# EasyEDA schematic SCH_R2.json

## Sheets
1 Atmega MCU copy: TITLE: Keyboard Atmega Controller; REV: 1.0; Date: 2022-01-07; Sheet: 1/1; Drawn By: @Engr. Ahsan Awan; Company: WhatsApp(+923491540717)
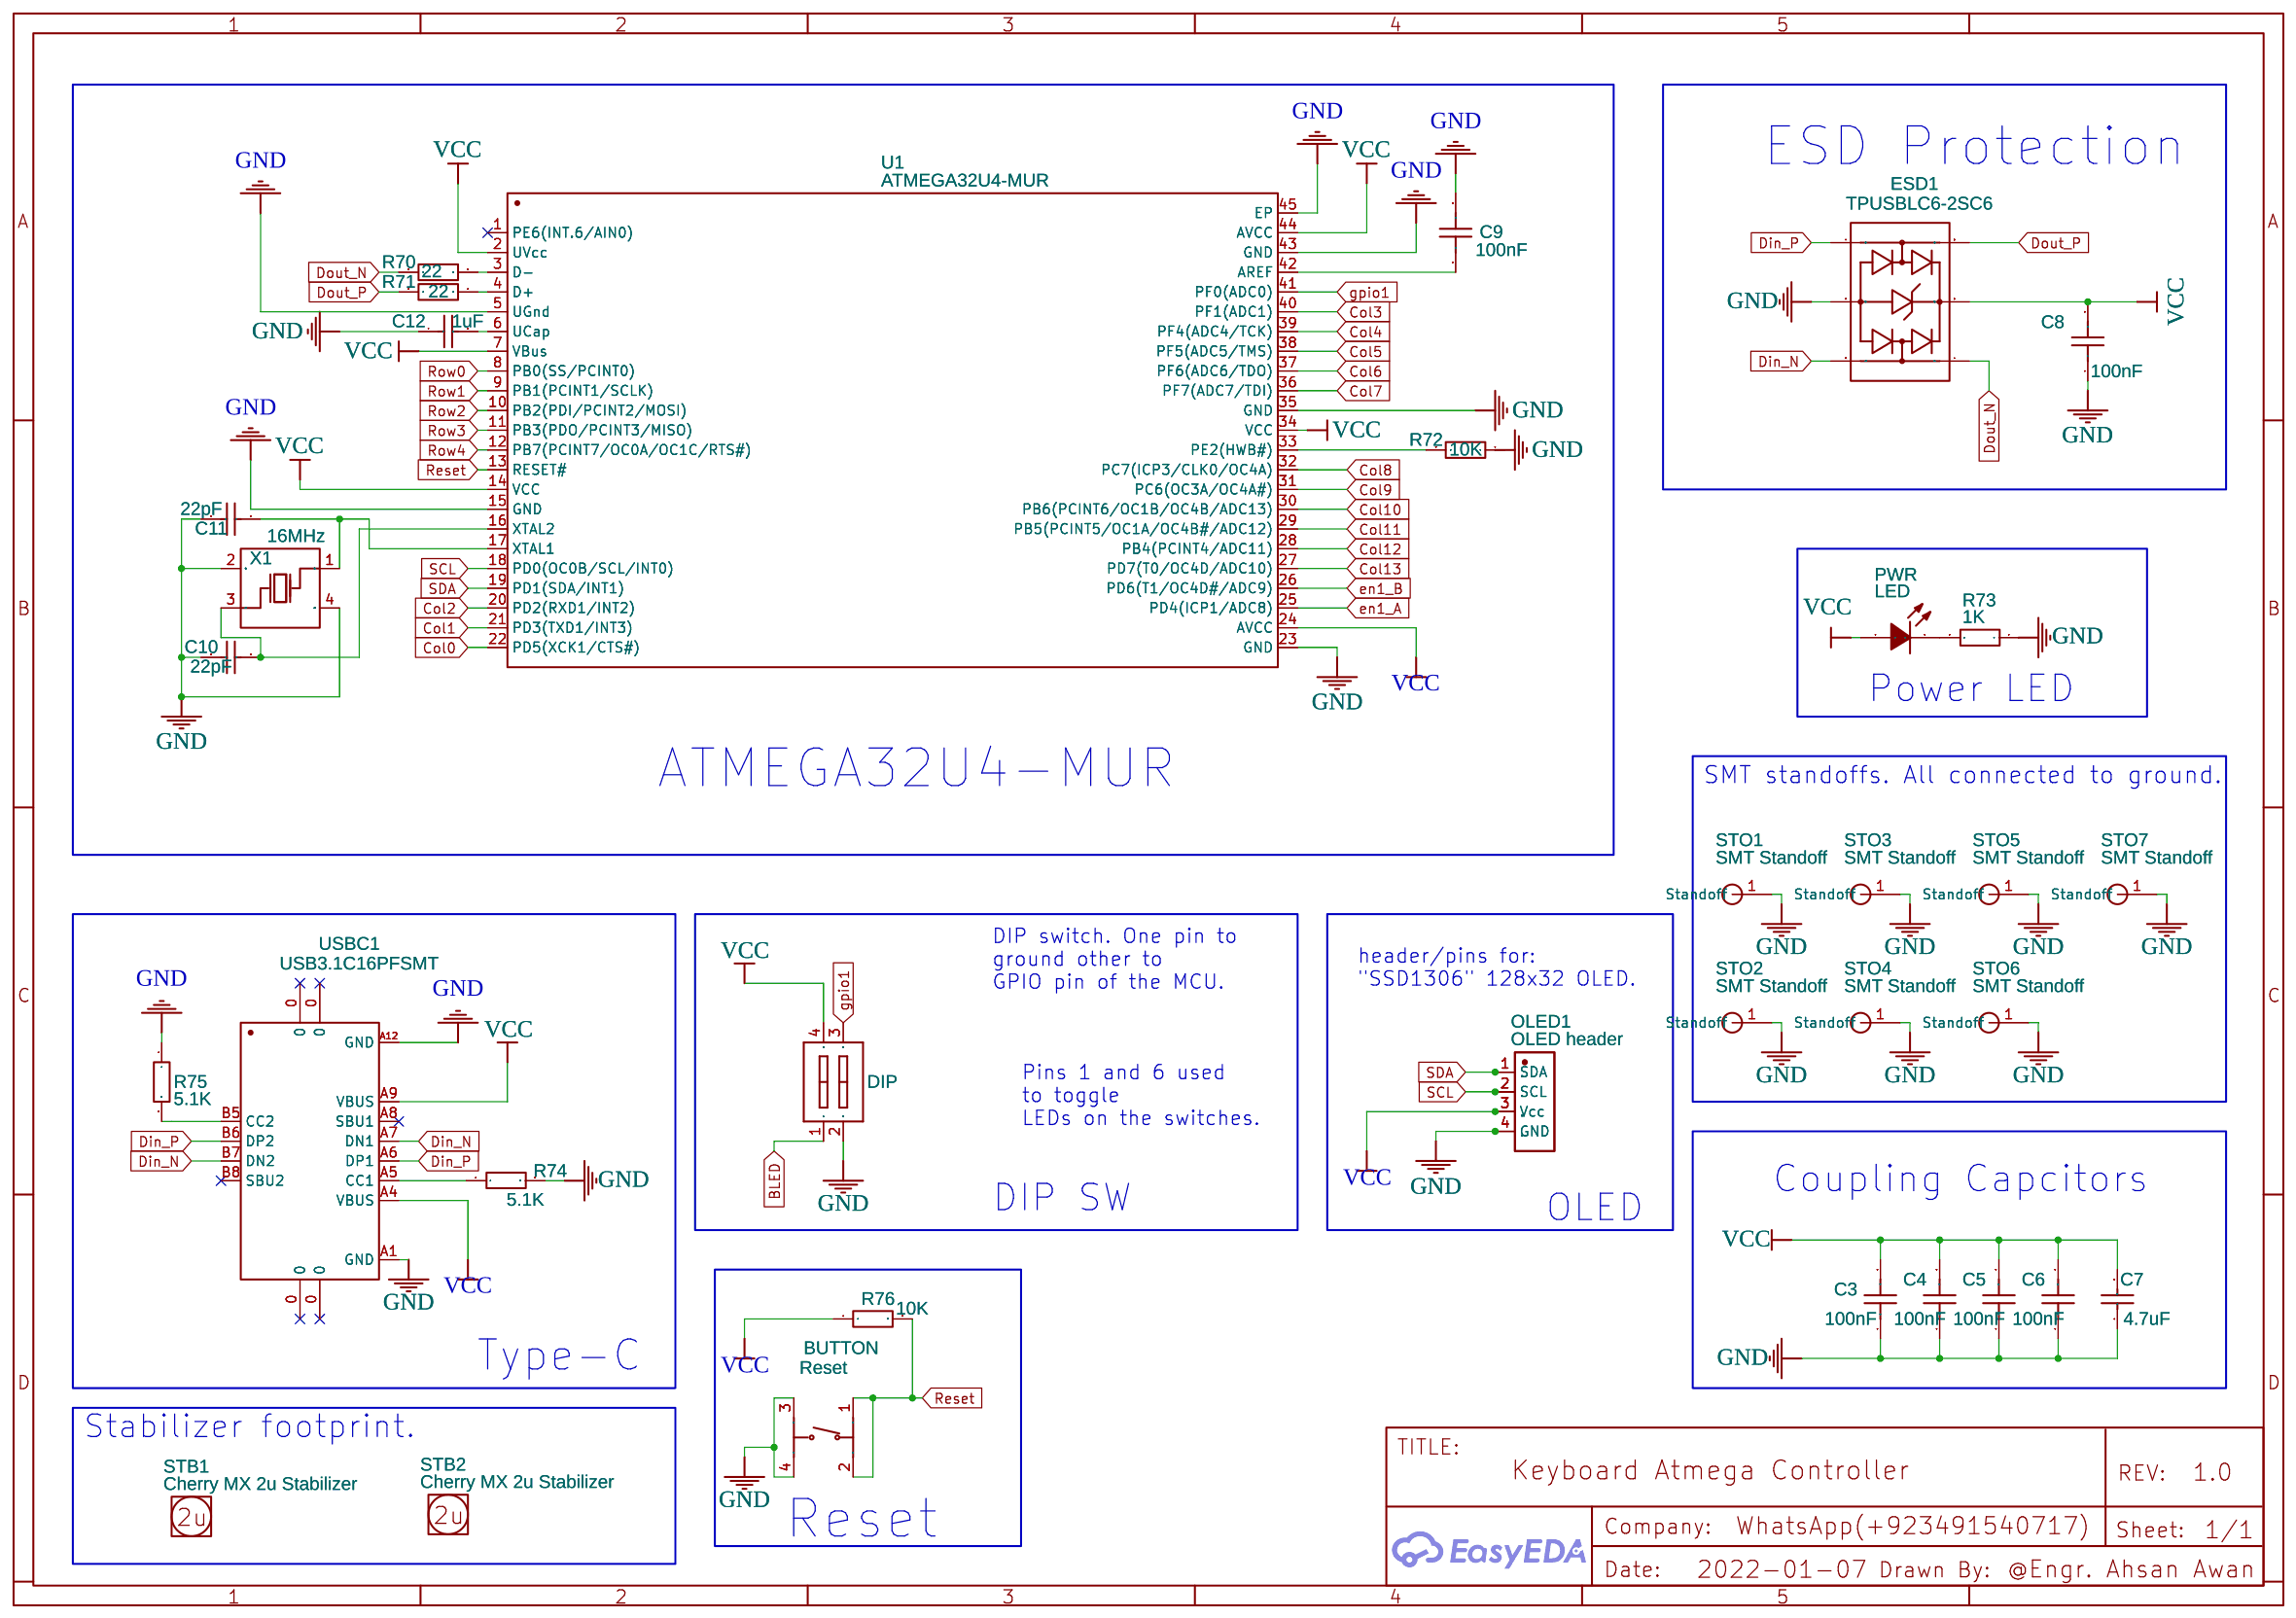
[diagram p0: Atmega MCU copy]
2 First 6 Colimn: TITLE: Switch Matrix; Date: 2022-01-30; Company: Your Company
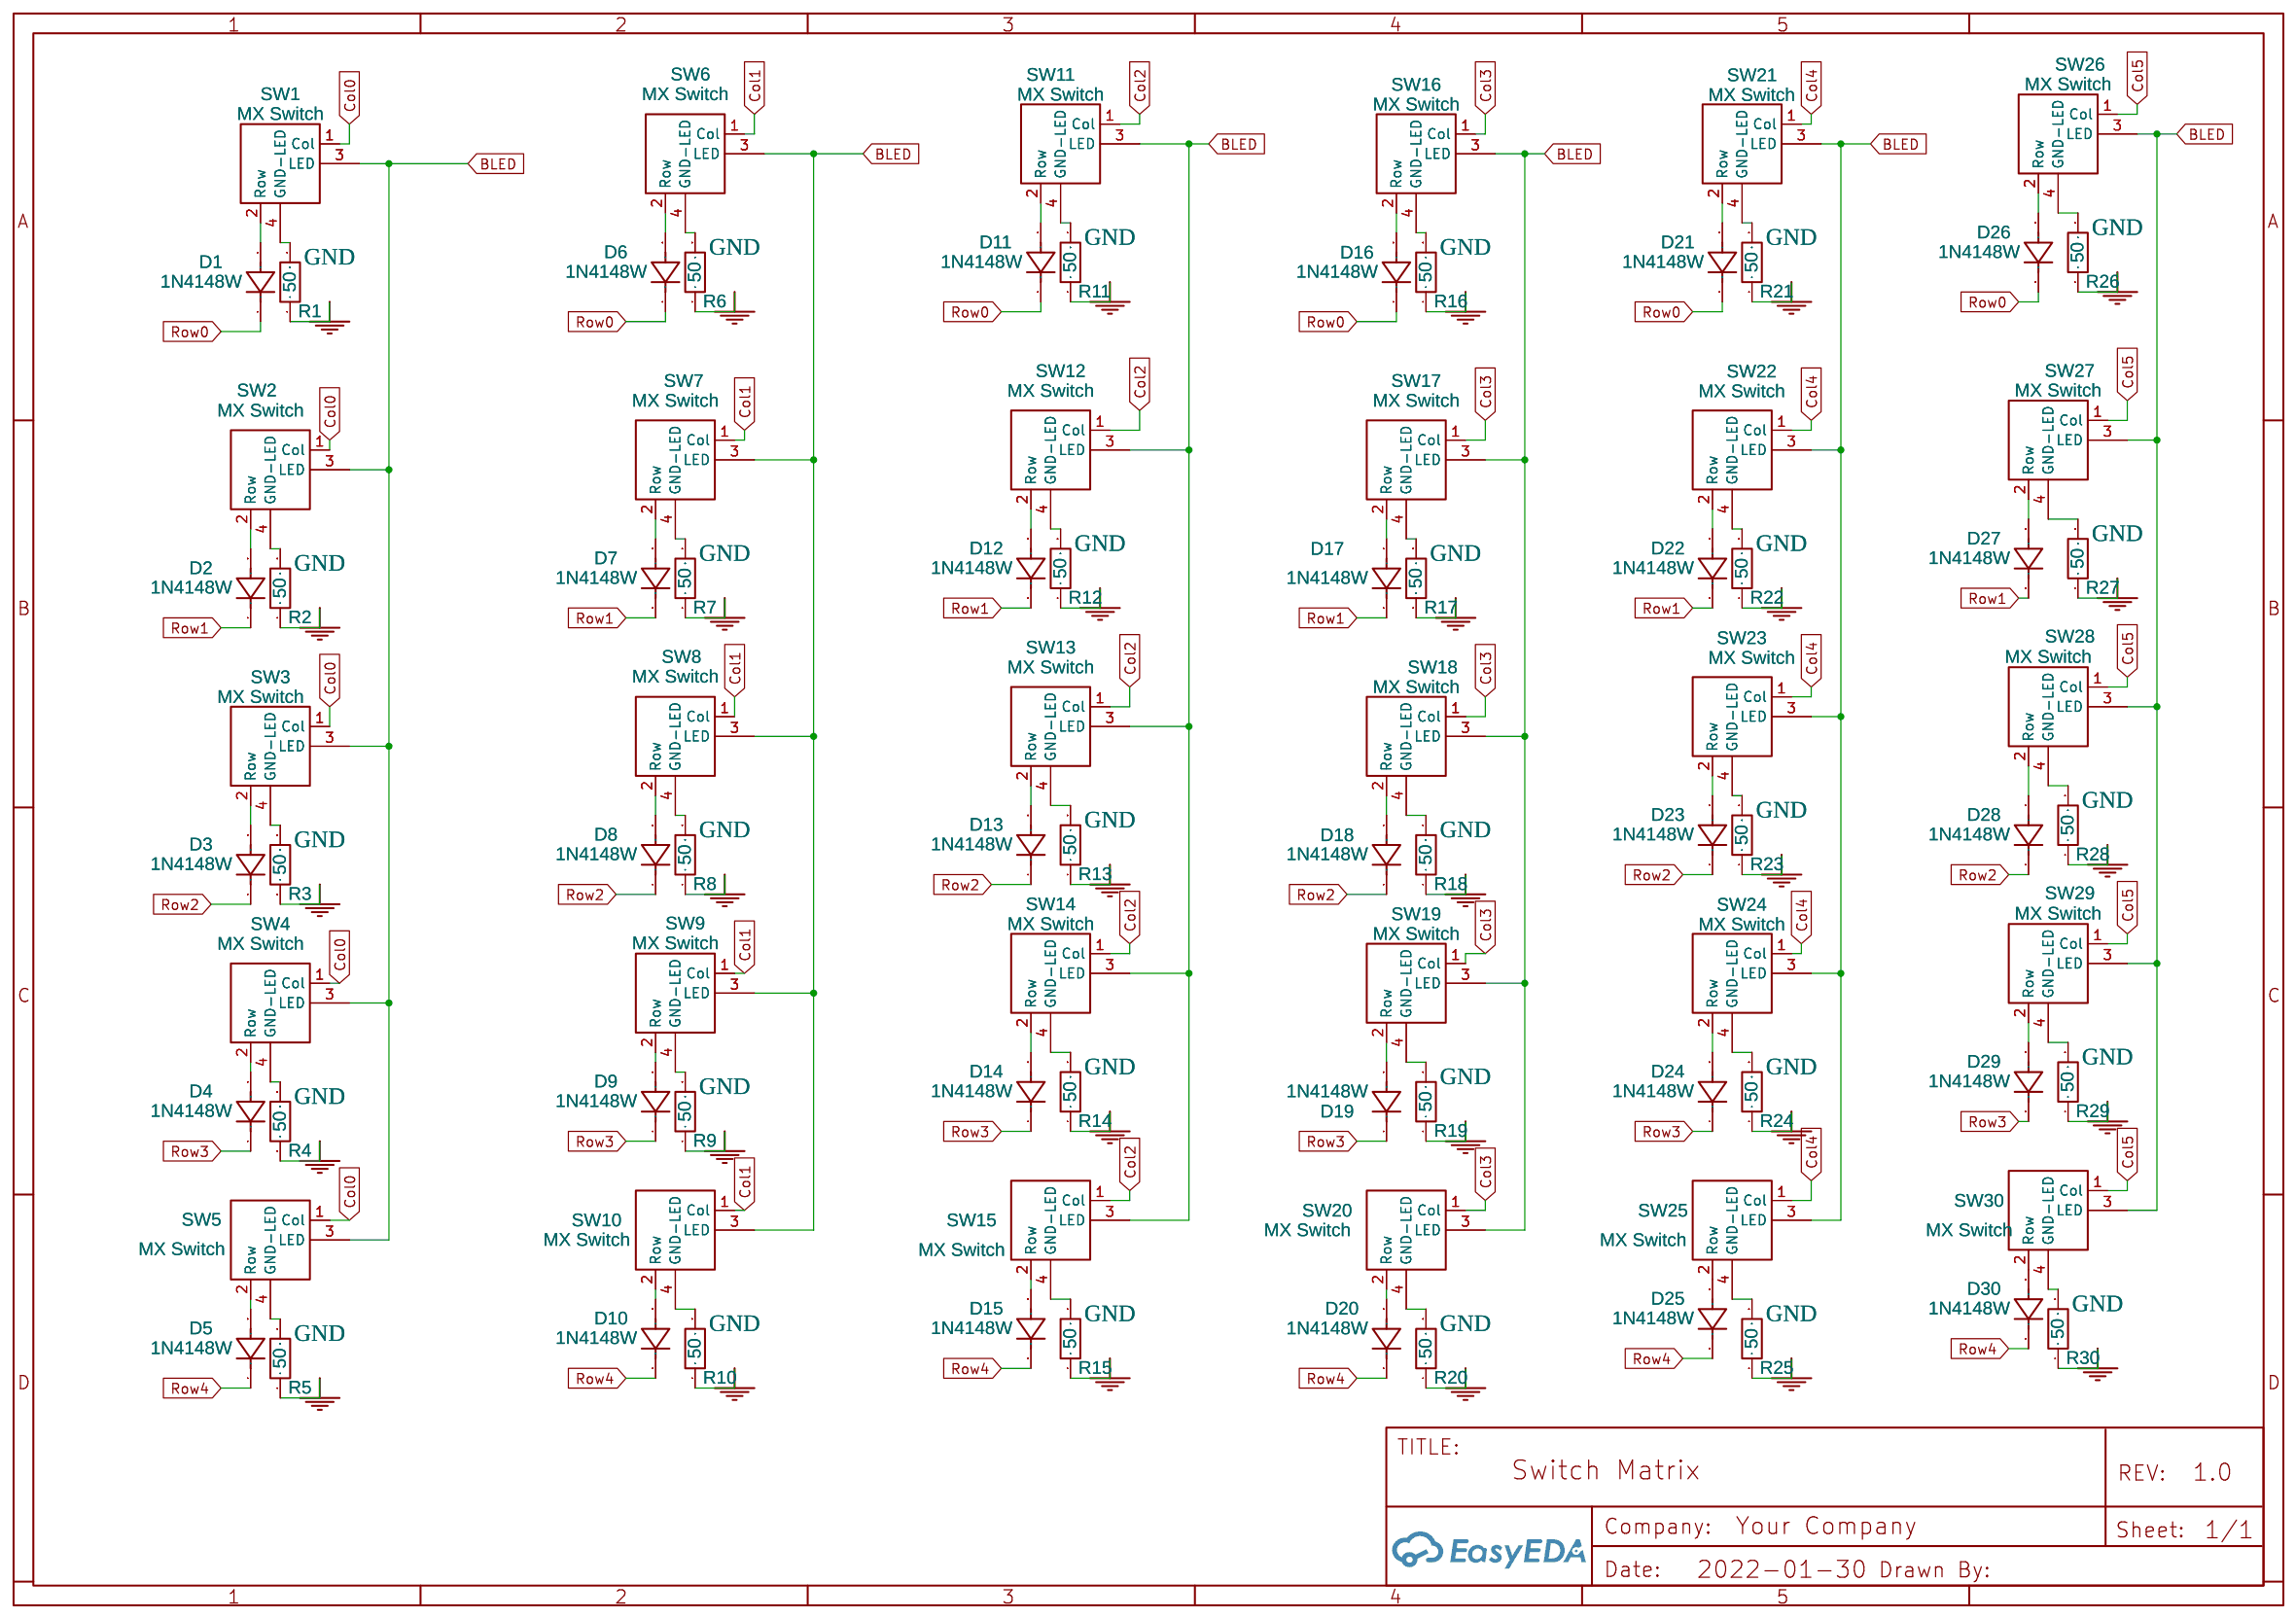
[diagram p1: First 6 Colimn]
3 Last 8 Col: TITLE: Switch Matrix; REV: 1.1
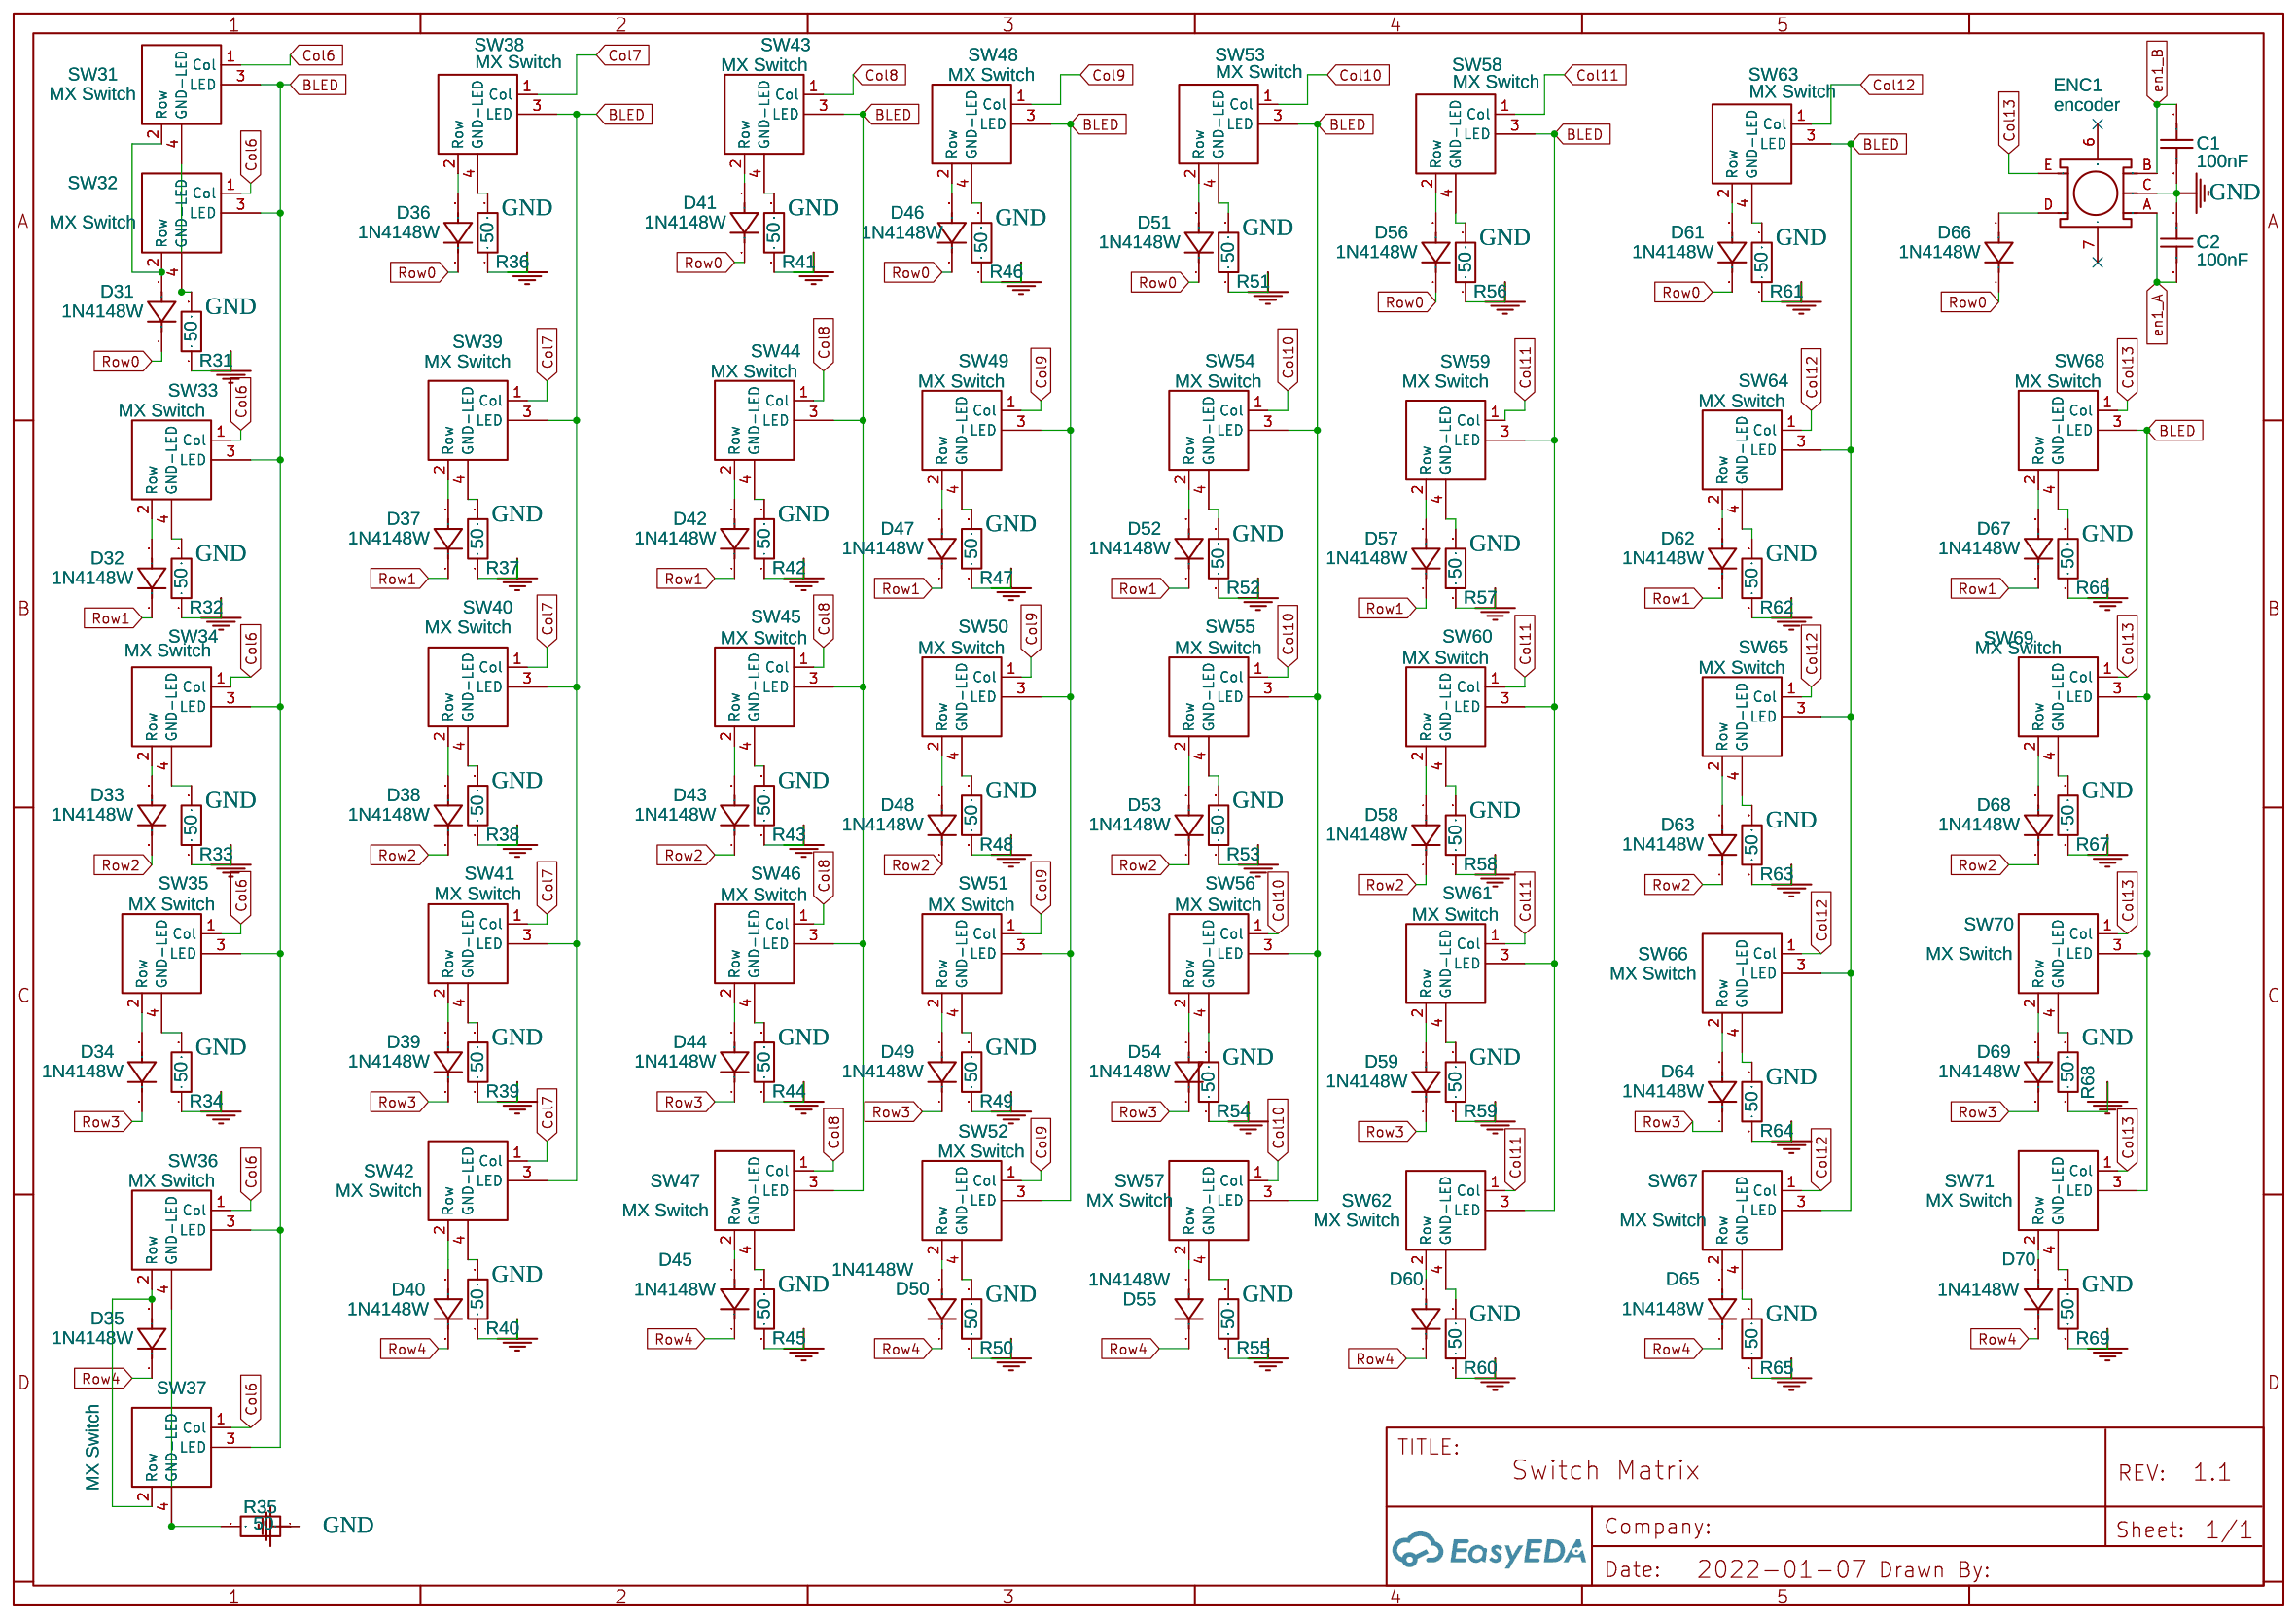
[diagram p2: Last 8 Col]

## Parts
sheet Atmega MCU copy
BUTTON  Reset  [SW-SMD_4P-L5.1-W5.1-P3.70-LS6.5-TL-2]
C3  100nF  [C0603]
C4  100nF  [C0603]
C5  100nF  [C0603]
C6  100nF  [C0603]
C7  4.7uF  [C0603]
C8  100nF  [C0603]
C9  100nF  [C0603]
C10  22pF  [C0603]
C11  22pF  [C0603]
C12  1uF  [C0603]
DIP  DSIC02LS-P_C489174  [SW-SMD_4P-L5.1-W6.1-P2.54-LS9.8]
ESD1  TPUSBLC6-2SC6  [SOT-23-6_L2.9-W1.6-P0.95-LS2.8-BR]
OLED1  OLED header  [HDR-SMD_4P-P2.00-H-M-W6.0-N]
PWR  LED  [LED0805-R-RD]
R70  22  [R0603]
R71  22  [R0603]
R72  10K  [R0603]
R73  1K  [R0603]
R74  5.1K  [R0603]
R75  5.1K  [R0603]
R76  10K  [R0603]
STB1  Cherry MX 2u Stabilizer  [MX1A STABILIZER 2U]
STB2  Cherry MX 2u Stabilizer  [MX1A STABILIZER 2U]
STO1  SMT Standoff  [SMT STANDOFF]
STO2  SMT Standoff  [SMT STANDOFF]
STO3  SMT Standoff  [SMT STANDOFF]
STO4  SMT Standoff  [SMT STANDOFF]
STO5  SMT Standoff  [SMT STANDOFF]
STO6  SMT Standoff  [SMT STANDOFF]
STO7  SMT Standoff  [SMT STANDOFF]
U1  ATMEGA32U4-MUR  [VQFN-44_L7.0-W7.0-P0.50-BL-EP5.2]
U2  x  [1X04-CLEANBIG]
USBC1  USB3.1C16PFSMT  [USB-C-SMD_TYPE-C-USB-17]
X1  16MHz  [OSC-SMD_4P-L3.2-W2.5-BL]
sheet First 6 Colimn
D1  1N4148W  [SOD-123_L2.7-W1.6-LS3.7-RD]
D2  1N4148W  [SOD-123_L2.7-W1.6-LS3.7-RD]
D3  1N4148W  [SOD-123_L2.7-W1.6-LS3.7-RD]
D4  1N4148W  [SOD-123_L2.7-W1.6-LS3.7-RD]
D5  1N4148W  [SOD-123_L2.7-W1.6-LS3.7-RD]
D6  1N4148W  [SOD-123_L2.7-W1.6-LS3.7-RD]
D7  1N4148W  [SOD-123_L2.7-W1.6-LS3.7-RD]
D8  1N4148W  [SOD-123_L2.7-W1.6-LS3.7-RD]
D9  1N4148W  [SOD-123_L2.7-W1.6-LS3.7-RD]
D10  1N4148W  [SOD-123_L2.7-W1.6-LS3.7-RD]
D11  1N4148W  [SOD-123_L2.7-W1.6-LS3.7-RD]
D12  1N4148W  [SOD-123_L2.7-W1.6-LS3.7-RD]
D13  1N4148W  [SOD-123_L2.7-W1.6-LS3.7-RD]
D14  1N4148W  [SOD-123_L2.7-W1.6-LS3.7-RD]
D15  1N4148W  [SOD-123_L2.7-W1.6-LS3.7-RD]
D16  1N4148W  [SOD-123_L2.7-W1.6-LS3.7-RD]
D17  1N4148W  [SOD-123_L2.7-W1.6-LS3.7-RD]
D18  1N4148W  [SOD-123_L2.7-W1.6-LS3.7-RD]
D19  1N4148W  [SOD-123_L2.7-W1.6-LS3.7-RD]
D20  1N4148W  [SOD-123_L2.7-W1.6-LS3.7-RD]
D21  1N4148W  [SOD-123_L2.7-W1.6-LS3.7-RD]
D22  1N4148W  [SOD-123_L2.7-W1.6-LS3.7-RD]
D23  1N4148W  [SOD-123_L2.7-W1.6-LS3.7-RD]
D24  1N4148W  [SOD-123_L2.7-W1.6-LS3.7-RD]
D25  1N4148W  [SOD-123_L2.7-W1.6-LS3.7-RD]
D26  1N4148W  [SOD-123_L2.7-W1.6-LS3.7-RD]
D27  1N4148W  [SOD-123_L2.7-W1.6-LS3.7-RD]
D28  1N4148W  [SOD-123_L2.7-W1.6-LS3.7-RD]
D29  1N4148W  [SOD-123_L2.7-W1.6-LS3.7-RD]
D30  1N4148W  [SOD-123_L2.7-W1.6-LS3.7-RD]
R1  50  [R0603]
R2  50  [R0603]
R3  50  [R0603]
R4  50  [R0603]
R5  50  [R0603]
R6  50  [R0603]
R7  50  [R0603]
R8  50  [R0603]
R9  50  [R0603]
R10  50  [R0603]
R11  50  [R0603]
R12  50  [R0603]
R13  50  [R0603]
R14  50  [R0603]
R15  50  [R0603]
R16  50  [R0603]
R17  50  [R0603]
R18  50  [R0603]
R19  50  [R0603]
R20  50  [R0603]
R21  50  [R0603]
R22  50  [R0603]
R23  50  [R0603]
R24  50  [R0603]
R25  50  [R0603]
R26  50  [R0603]
R27  50  [R0603]
R28  50  [R0603]
R29  50  [R0603]
R30  50  [R0603]
SW1  MX Switch  [MX-ALPS-CHOC-SWITCH]
SW2  MX Switch  [MX-ALPS-CHOC-SWITCH]
SW3  MX Switch  [MX-ALPS-CHOC-SWITCH]
SW4  MX Switch  [MX-ALPS-CHOC-SWITCH]
SW5  MX Switch  [MX-ALPS-CHOC-SWITCH]
SW6  MX Switch  [MX-ALPS-CHOC-SWITCH]
SW7  MX Switch  [MX-ALPS-CHOC-SWITCH]
SW8  MX Switch  [MX-ALPS-CHOC-SWITCH]
SW9  MX Switch  [MX-ALPS-CHOC-SWITCH]
SW10  MX Switch  [MX-ALPS-CHOC-SWITCH]
SW11  MX Switch  [MX-ALPS-CHOC-SWITCH]
SW12  MX Switch  [MX-ALPS-CHOC-SWITCH]
SW13  MX Switch  [MX-ALPS-CHOC-SWITCH]
SW14  MX Switch  [MX-ALPS-CHOC-SWITCH]
SW15  MX Switch  [MX-ALPS-CHOC-SWITCH]
SW16  MX Switch  [MX-ALPS-CHOC-SWITCH]
SW17  MX Switch  [MX-ALPS-CHOC-SWITCH]
SW18  MX Switch  [MX-ALPS-CHOC-SWITCH]
SW19  MX Switch  [MX-ALPS-CHOC-SWITCH]
SW20  MX Switch  [MX-ALPS-CHOC-SWITCH]
SW21  MX Switch  [MX-ALPS-CHOC-SWITCH]
SW22  MX Switch  [MX-ALPS-CHOC-SWITCH]
SW23  MX Switch  [MX-ALPS-CHOC-SWITCH]
SW24  MX Switch  [MX-ALPS-CHOC-SWITCH]
SW25  MX Switch  [MX-ALPS-CHOC-SWITCH]
SW26  MX Switch  [MX-ALPS-CHOC-SWITCH]
SW27  MX Switch  [MX-ALPS-CHOC-SWITCH]
SW28  MX Switch  [MX-ALPS-CHOC-SWITCH]
SW29  MX Switch  [MX-ALPS-CHOC-SWITCH]
SW30  MX Switch  [MX-ALPS-CHOC-SWITCH]
sheet Last 8 Col
C1  100nF  [C0603]
C2  100nF  [C0603]
D31  1N4148W  [SOD-123_L2.7-W1.6-LS3.7-RD]
D32  1N4148W  [SOD-123_L2.7-W1.6-LS3.7-RD]
D33  1N4148W  [SOD-123_L2.7-W1.6-LS3.7-RD]
D34  1N4148W  [SOD-123_L2.7-W1.6-LS3.7-RD]
D35  1N4148W  [SOD-123_L2.7-W1.6-LS3.7-RD]
D36  1N4148W  [SOD-123_L2.7-W1.6-LS3.7-RD]
D37  1N4148W  [SOD-123_L2.7-W1.6-LS3.7-RD]
D38  1N4148W  [SOD-123_L2.7-W1.6-LS3.7-RD]
D39  1N4148W  [SOD-123_L2.7-W1.6-LS3.7-RD]
D40  1N4148W  [SOD-123_L2.7-W1.6-LS3.7-RD]
D41  1N4148W  [SOD-123_L2.7-W1.6-LS3.7-RD]
D42  1N4148W  [SOD-123_L2.7-W1.6-LS3.7-RD]
D43  1N4148W  [SOD-123_L2.7-W1.6-LS3.7-RD]
D44  1N4148W  [SOD-123_L2.7-W1.6-LS3.7-RD]
D45  1N4148W  [SOD-123_L2.7-W1.6-LS3.7-RD]
D46  1N4148W  [SOD-123_L2.7-W1.6-LS3.7-RD]
D47  1N4148W  [SOD-123_L2.7-W1.6-LS3.7-RD]
D48  1N4148W  [SOD-123_L2.7-W1.6-LS3.7-RD]
D49  1N4148W  [SOD-123_L2.7-W1.6-LS3.7-RD]
D50  1N4148W  [SOD-123_L2.7-W1.6-LS3.7-RD]
D51  1N4148W  [SOD-123_L2.7-W1.6-LS3.7-RD]
D52  1N4148W  [SOD-123_L2.7-W1.6-LS3.7-RD]
D53  1N4148W  [SOD-123_L2.7-W1.6-LS3.7-RD]
D54  1N4148W  [SOD-123_L2.7-W1.6-LS3.7-RD]
D55  1N4148W  [SOD-123_L2.7-W1.6-LS3.7-RD]
D56  1N4148W  [SOD-123_L2.7-W1.6-LS3.7-RD]
D57  1N4148W  [SOD-123_L2.7-W1.6-LS3.7-RD]
D58  1N4148W  [SOD-123_L2.7-W1.6-LS3.7-RD]
D59  1N4148W  [SOD-123_L2.7-W1.6-LS3.7-RD]
D60  1N4148W  [SOD-123_L2.7-W1.6-LS3.7-RD]
D61  1N4148W  [SOD-123_L2.7-W1.6-LS3.7-RD]
D62  1N4148W  [SOD-123_L2.7-W1.6-LS3.7-RD]
D63  1N4148W  [SOD-123_L2.7-W1.6-LS3.7-RD]
D64  1N4148W  [SOD-123_L2.7-W1.6-LS3.7-RD]
D65  1N4148W  [SOD-123_L2.7-W1.6-LS3.7-RD]
D66  1N4148W  [SOD-123_L2.7-W1.6-LS3.7-RD]
D67  1N4148W  [SOD-123_L2.7-W1.6-LS3.7-RD]
D68  1N4148W  [SOD-123_L2.7-W1.6-LS3.7-RD]
D69  1N4148W  [SOD-123_L2.7-W1.6-LS3.7-RD]
D70  1N4148W  [SOD-123_L2.7-W1.6-LS3.7-RD]
ENC1  encoder  [PRETTY_ENCODER]
NO?#1  NO
R31  50  [R0603]
R32  50  [R0603]
R33  50  [R0603]
R34  50  [R0603]
R35  50  [R0603]
R36  50  [R0603]
R37  50  [R0603]
R38  50  [R0603]
R39  50  [R0603]
R40  50  [R0603]
R41  50  [R0603]
R42  50  [R0603]
R43  50  [R0603]
R44  50  [R0603]
R45  50  [R0603]
R46  50  [R0603]
R47  50  [R0603]
R48  50  [R0603]
R49  50  [R0603]
R50  50  [R0603]
R51  50  [R0603]
R52  50  [R0603]
R53  50  [R0603]
R54  50  [R0603]
R55  50  [R0603]
R56  50  [R0603]
R57  50  [R0603]
R58  50  [R0603]
R59  50  [R0603]
R60  50  [R0603]
R61  50  [R0603]
R62  50  [R0603]
R63  50  [R0603]
R64  50  [R0603]
R65  50  [R0603]
R66  50  [R0603]
R67  50  [R0603]
R68  50  [R0603]
R69  50  [R0603]
SW31  MX Switch  [MX-ALPS-CHOC-SWITCH]
SW32  MX Switch  [MX-ALPS-CHOC-SWITCH]
SW33  MX Switch  [MX-ALPS-CHOC-SWITCH]
SW34  MX Switch  [MX-ALPS-CHOC-SWITCH]
SW35  MX Switch  [MX-ALPS-CHOC-SWITCH]
SW36  MX Switch  [MX-ALPS-CHOC-SWITCH]
SW37  MX Switch  [MX-ALPS-CHOC-SWITCH]
SW38  MX Switch  [MX-ALPS-CHOC-SWITCH]
SW39  MX Switch  [MX-ALPS-CHOC-SWITCH]
SW40  MX Switch  [MX-ALPS-CHOC-SWITCH]
SW41  MX Switch  [MX-ALPS-CHOC-SWITCH]
SW42  MX Switch  [MX-ALPS-CHOC-SWITCH]
SW43  MX Switch  [MX-ALPS-CHOC-SWITCH]
SW44  MX Switch  [MX-ALPS-CHOC-SWITCH]
SW45  MX Switch  [MX-ALPS-CHOC-SWITCH]
SW46  MX Switch  [MX-ALPS-CHOC-SWITCH]
SW47  MX Switch  [MX-ALPS-CHOC-SWITCH]
SW48  MX Switch  [MX-ALPS-CHOC-SWITCH]
SW49  MX Switch  [MX-ALPS-CHOC-SWITCH]
SW50  MX Switch  [MX-ALPS-CHOC-SWITCH]
SW51  MX Switch  [MX-ALPS-CHOC-SWITCH]
SW52  MX Switch  [MX-ALPS-CHOC-SWITCH]
SW53  MX Switch  [MX-ALPS-CHOC-SWITCH]
SW54  MX Switch  [MX-ALPS-CHOC-SWITCH]
SW55  MX Switch  [MX-ALPS-CHOC-SWITCH]
SW56  MX Switch  [MX-ALPS-CHOC-SWITCH]
SW57  MX Switch  [MX-ALPS-CHOC-SWITCH]
SW58  MX Switch  [MX-ALPS-CHOC-SWITCH]
SW59  MX Switch  [MX-ALPS-CHOC-SWITCH]
SW60  MX Switch  [MX-ALPS-CHOC-SWITCH]
SW61  MX Switch  [MX-ALPS-CHOC-SWITCH]
SW62  MX Switch  [MX-ALPS-CHOC-SWITCH]
SW63  MX Switch  [MX-ALPS-CHOC-SWITCH]
SW64  MX Switch  [MX-ALPS-CHOC-SWITCH]
SW65  MX Switch  [MX-ALPS-CHOC-SWITCH]
SW66  MX Switch  [MX-ALPS-CHOC-SWITCH]
SW67  MX Switch  [MX-ALPS-CHOC-SWITCH]
SW68  MX Switch  [MX-ALPS-CHOC-SWITCH]
SW69  MX Switch  [MX-ALPS-CHOC-SWITCH]
SW70  MX Switch  [MX-ALPS-CHOC-SWITCH]
SW71  MX Switch  [MX-ALPS-CHOC-SWITCH]

## Library data of the parts
BUTTON = TS-1187A-B-A-B: Supplier: LCSC; Supplier Part: C318884; Manufacturer: XKB Enterprise; Contributor: LCSC; JLCPCB Part Class: Extended Part
C1-C6 C8 C9 = CC0603KRX7R9BB104: Supplier: LCSC; Manufacturer: YAGEO; Supplier Part: C14663; JLCPCB Part Class: Basic Part
C7 = CL10A475KO8NNNC: Supplier: LCSC; Manufacturer: SAMSUNG; Supplier Part: C19666; JLCPCB Part Class: Basic Part
C10 C11 = CL10C220JB8NNNC: Supplier: LCSC; Manufacturer: SAMSUNG; Supplier Part: C1653; JLCPCB Part Class: Basic Part
C12 = CL10A105KB8NNNC: Supplier: LCSC; Manufacturer: SAMSUNG; Supplier Part: C15849; JLCPCB Part Class: Basic Part
DIP = DSIC02LS-P_C489174: Supplier: LCSC; Supplier Part: C489174; Manufacturer: XKB Enterprise; Manufacturer Part: DSIC02LS-P; Contributor: LCSC; JLCPCB Part Class: Extended Part
ESD1 = TPUSBLC6-2SC6: Supplier: LCSC; Supplier Part: C558442; Manufacturer: TECH PUBLIC; Contributor: LCSC; JLCPCB Part Class: Extended Part
OLED1 = X4611WRS-04I-C40D28: Supplier: LCSC; Supplier Part: C917591; Manufacturer: XKB Connectivity; Contributor: LCSC; JLCPCB Part Class: Extended Part
PWR = TJ-S2012SW8TGLC6B-A5: Supplier: LCSC; Supplier Part: C192320; Manufacturer: TOGIALED; Contributor: LCSC; JLCPCB Part Class: Extended Part
R70 R71 = 0603WAF220JT5E: Supplier: LCSC; Manufacturer: UniOhm; Supplier Part: C23345; JLCPCB Part Class: Basic Part
R72 R76 = 0603WAF1002T5E: Supplier: LCSC; Manufacturer: UniOhm; Supplier Part: C25804; JLCPCB Part Class: Basic Part
R73 = TR0603B1KP0525: Supplier: LCSC; Supplier Part: C188364; Manufacturer: Ever Ohms Tech; Contributor: LCSC; JLCPCB Part Class: Extended Part
R74 R75 = RMC06035.1K1%N: Supplier: LCSC; Supplier Part: C269716; Manufacturer: Tyohm; Contributor: LCSC; JLCPCB Part Class: Extended Part
STB1 STB2 = Cherry MX 2u Stabilizer: Manufacturer Part: G99-0742; link: http://www.mouser.com/ds/2/71/mx_cat-1079739.pdf; Supplier Part: 540-G99-0742; Supplier: Mouser
STO1-STO7 = SMT Standoff: Manufacturer: Würth Elektronik; Manufacturer Part: 9774040151R; Supplier: Digi-Key; Supplier Part: 9774040151R; link: https://www.digikey.com/en/products/detail/w%C3%BCrth-elektronik/9774040151R/5320632?s=N4IgTCBcDaIJwHYEBYAMaCMBWDAlEAugL5A; Contributor: Matias Moragrega Sánchez de la Barquera
U1 = ATMEGA32U4-MUR: Contributor: KiCad; Supplier: LCSC; Manufacturer: MICROCHIP; Supplier Part: C45874; JLCPCB Part Class: Extended Part
U2 = PZ2.54-1X4P-ZW: Supplier: LCSC; Supplier Part: C2837836; Manufacturer: null; JLCPCB Part Class: Extended Part; Contributor: LCSC
USBC1 = USB3.1C16PFSMT: Supplier: LCSC; Supplier Part: C167321; Manufacturer: LCSC; Contributor: LCSC; JLCPCB Part Class: Extended Part
X1 = X322516MLB4SI: Supplier: LCSC; Manufacturer: YXC; Supplier Part: C13738; JLCPCB Part Class: Basic Part
D1-D70 = 1N4148W_C2828417: Supplier: LCSC; Supplier Part: C2828417; Manufacturer: CBI(创基); JLCPCB Part Class: Extended Part; Contributor: LCSC
R1-R69 = HP03W5F500JT5E: Supplier: LCSC; Supplier Part: C2759402; Manufacturer: UNI-ROYAL(厚声); JLCPCB Part Class: Extended Part; Contributor: LCSC
SW1-SW71 = MX Switch: Supplier Part: Cherry MX or Alps/Matias switch; Contributor: mmoragrega
ENC1 = EC11E18244AU: Supplier: LCSC; Supplier Part: C202365; Manufacturer: ALPS Electric; Contributor: LCSC; JLCPCB Part Class: Extended Part
NO?#1 = -: BOM_Manufacturer Part: ?

## Nets
GND: BUTTON.3(C) BUTTON.4(D) C1.2 C2.1 C3.1 C4.1 C5.1 C6.1 C7.1 C8.1 C9.2 C10.1 C11.1 C12.1 DIP.2(A2) ENC1.C ESD1.2(GND) OLED1.4(GND) R1.1 R2.1 R3.1 R4.1 R5.1 R6.1 R7.1 R8.1 R9.1 R10.1 R11.1 R12.1 R13.1 R14.1 R15.1 R16.1 R17.1 R18.1 R19.1 R20.1 R21.1 R22.1 R23.1 R24.1 R25.1 R26.1 R27.1 R28.1 R29.1 R30.1 R31.1 R32.1 R33.1 R34.1 R35.1 R36.1 R37.1 R38.1 R39.1 R40.1 R41.1 R42.1 R43.1 R44.1 R45.1 R46.1 R47.1 R48.1 R49.1 R50.1 R51.1 R52.1 R53.1 R54.1 R55.1 R56.1 R57.1 R58.1 R59.1 R60.1 R61.1 R62.1 R63.1 R64.1 R65.1 R66.1 R67.1 R68.1 R69.1 R72.1 R73.1 R74.2 R75.1 STO1.1(Standoff) STO2.1(Standoff) STO3.1(Standoff) STO4.1(Standoff) STO5.1(Standoff) STO6.1(Standoff) STO7.1(Standoff) U1.5(UGnd) U1.15(GND) U1.23(GND) U1.35(GND) U1.43(GND) U1.45(EP) U2.4(.) USBC1.A1(GND) USBC1.A12(GND) X1.2(GND) X1.4(GND)
VCC: C3.2 C4.2 C5.2 C6.2 C7.2 C8.2 DIP.4(B1) ESD1.5(VBUS) OLED1.3(Vcc) PWR.1(A) R76.1 U1.2(UVcc) U1.7(VBus) U1.14(VCC) U1.24(AVCC) U1.34(VCC) U1.44(AVCC) U2.3(.) USBC1.A4(VBUS) USBC1.A9(VBUS)
BLED: DIP.1(A1) SW1.3(LED) SW2.3(LED) SW3.3(LED) SW4.3(LED) SW5.3(LED) SW6.3(LED) SW7.3(LED) SW8.3(LED) SW9.3(LED) SW10.3(LED) SW11.3(LED) SW12.3(LED) SW13.3(LED) SW14.3(LED) SW15.3(LED) SW16.3(LED) SW17.3(LED) SW18.3(LED) SW19.3(LED) SW20.3(LED) SW21.3(LED) SW22.3(LED) SW23.3(LED) SW24.3(LED) SW25.3(LED) SW26.3(LED) SW27.3(LED) SW28.3(LED) SW29.3(LED) SW30.3(LED) SW31.3(LED) SW32.3(LED) SW33.3(LED) SW34.3(LED) SW35.3(LED) SW36.3(LED) SW37.3(LED) SW38.3(LED) SW39.3(LED) SW40.3(LED) SW41.3(LED) SW42.3(LED) SW43.3(LED) SW44.3(LED) SW45.3(LED) SW46.3(LED) SW47.3(LED) SW48.3(LED) SW49.3(LED) SW50.3(LED) SW51.3(LED) SW52.3(LED) SW53.3(LED) SW54.3(LED) SW55.3(LED) SW56.3(LED) SW57.3(LED) SW58.3(LED) SW59.3(LED) SW60.3(LED) SW61.3(LED) SW62.3(LED) SW63.3(LED) SW64.3(LED) SW65.3(LED) SW66.3(LED) SW67.3(LED) SW68.3(LED) SW69.3(LED) SW70.3(LED) SW71.3(LED)
Col0: SW1.1(Col) SW2.1(Col) SW3.1(Col) SW4.1(Col) SW5.1(Col) U1.22(PD5(XCK1/CTS#))
Col1: SW6.1(Col) SW7.1(Col) SW8.1(Col) SW9.1(Col) SW10.1(Col) U1.21(PD3(TXD1/INT3))
Col2: SW11.1(Col) SW12.1(Col) SW13.1(Col) SW14.1(Col) SW15.1(Col) U1.20(PD2(RXD1/INT2))
Col3: SW16.1(Col) SW17.1(Col) SW18.1(Col) SW19.1(Col) SW20.1(Col) U1.40(PF1(ADC1))
Col4: SW21.1(Col) SW22.1(Col) SW23.1(Col) SW24.1(Col) SW25.1(Col) U1.39(PF4(ADC4/TCK))
Col5: SW26.1(Col) SW27.1(Col) SW28.1(Col) SW29.1(Col) SW30.1(Col) U1.38(PF5(ADC5/TMS))
Col6: SW31.1(Col) SW32.1(Col) SW33.1(Col) SW34.1(Col) SW35.1(Col) SW36.1(Col) SW37.1(Col) U1.37(PF6(ADC6/TDO))
Col7: SW38.1(Col) SW39.1(Col) SW40.1(Col) SW41.1(Col) SW42.1(Col) U1.36(PF7(ADC7/TDI))
Col8: SW43.1(Col) SW44.1(Col) SW45.1(Col) SW46.1(Col) SW47.1(Col) U1.32(PC7(ICP3/CLK0/OC4A))
Col9: SW48.1(Col) SW49.1(Col) SW50.1(Col) SW51.1(Col) SW52.1(Col) U1.31(PC6(OC3A/OC4A#))
Col10: SW53.1(Col) SW54.1(Col) SW55.1(Col) SW56.1(Col) SW57.1(Col) U1.30(PB6(PCINT6/OC1B/OC4B/ADC13))
Col11: SW58.1(Col) SW59.1(Col) SW60.1(Col) SW61.1(Col) SW62.1(Col) U1.29(PB5(PCINT5/OC1A/OC4B#/ADC12))
Col12: SW63.1(Col) SW64.1(Col) SW65.1(Col) SW66.1(Col) SW67.1(Col) U1.28(PB4(PCINT4/ADC11))
Col13: ENC1.E SW68.1(Col) SW69.1(Col) SW70.1(Col) SW71.1(Col) U1.27(PD7(T0/OC4D/ADC10))
Din_N: ESD1.3(I/O2) USBC1.A7(DN1) USBC1.B7(DN2)
Din_P: ESD1.1(I/O1) USBC1.A6(DP1) USBC1.B6(DP2)
Dout_N: ESD1.4(I/O2) R70.2
Dout_P: ESD1.6(I/O1) R71.2
en1_A: C2.2 ENC1.A U1.25(PD4(ICP1/ADC8))
en1_B: C1.1 ENC1.B U1.26(PD6(T1/OC4D#/ADC9))
gpio1: DIP.3(B2) U1.41(PF0(ADC0))
Reset: BUTTON.1(A) BUTTON.2(B) R76.2 U1.13(RESET#)
Row0: D1.1(K) D6.1(K) D11.1(K) D16.1(K) D21.1(K) D26.1(K) D31.1(K) D36.1(K) D41.1(K) D46.1(K) D51.1(K) D56.1(K) D61.1(K) D66.1(K) U1.8(PB0(SS/PCINT0))
Row1: D2.1(K) D7.1(K) D12.1(K) D17.1(K) D22.1(K) D27.1(K) D32.1(K) D37.1(K) D42.1(K) D47.1(K) D52.1(K) D57.1(K) D62.1(K) D67.1(K) U1.9(PB1(PCINT1/SCLK))
Row2: D3.1(K) D8.1(K) D13.1(K) D18.1(K) D23.1(K) D28.1(K) D33.1(K) D38.1(K) D43.1(K) D48.1(K) D53.1(K) D58.1(K) D63.1(K) D68.1(K) U1.10(PB2(PDI/PCINT2/MOSI))
Row3: D4.1(K) D9.1(K) D14.1(K) D19.1(K) D24.1(K) D29.1(K) D34.1(K) D39.1(K) D44.1(K) D49.1(K) D54.1(K) D59.1(K) D64.1(K) D69.1(K) U1.11(PB3(PDO/PCINT3/MISO))
Row4: D5.1(K) D10.1(K) D15.1(K) D20.1(K) D25.1(K) D30.1(K) D35.1(K) D40.1(K) D45.1(K) D50.1(K) D55.1(K) D60.1(K) D65.1(K) D70.1(K) U1.12(PB7(PCINT7/OC0A/OC1C/RTS#))
SCL: OLED1.2(SCL) U1.18(PD0(OC0B/SCL/INT0)) U2.2(.)
SDA: OLED1.1(SDA) U1.19(PD1(SDA/INT1)) U2.1(.)
Net-(C9-1): C9.1 U1.42(AREF)
Net-(C10-2): C10.2 U1.16(XTAL2) X1.3(OSC2)
Net-(C11-2): C11.2 U1.17(XTAL1) X1.1(OSC1)
Net-(C12-2): C12.2 U1.6(UCap)
Net-(D1-2): D1.2(A) SW1.2(Row)
Net-(D2-2): D2.2(A) SW2.2(Row)
Net-(D3-2): D3.2(A) SW3.2(Row)
Net-(D4-2): D4.2(A) SW4.2(Row)
Net-(D5-2): D5.2(A) SW5.2(Row)
Net-(D6-2): D6.2(A) SW6.2(Row)
Net-(D7-2): D7.2(A) SW7.2(Row)
Net-(D8-2): D8.2(A) SW8.2(Row)
Net-(D9-2): D9.2(A) SW9.2(Row)
Net-(D10-2): D10.2(A) SW10.2(Row)
Net-(D11-2): D11.2(A) SW11.2(Row)
Net-(D12-2): D12.2(A) SW12.2(Row)
Net-(D13-2): D13.2(A) SW13.2(Row)
Net-(D14-2): D14.2(A) SW14.2(Row)
Net-(D15-2): D15.2(A) SW15.2(Row)
Net-(D16-2): D16.2(A) SW16.2(Row)
Net-(D17-2): D17.2(A) SW17.2(Row)
Net-(D18-2): D18.2(A) SW18.2(Row)
Net-(D19-2): D19.2(A) SW19.2(Row)
Net-(D20-2): D20.2(A) SW20.2(Row)
Net-(D21-2): D21.2(A) SW21.2(Row)
Net-(D22-2): D22.2(A) SW22.2(Row)
Net-(D23-2): D23.2(A) SW23.2(Row)
Net-(D24-2): D24.2(A) SW24.2(Row)
Net-(D25-2): D25.2(A) SW25.2(Row)
Net-(D26-2): D26.2(A) SW26.2(Row)
Net-(D27-2): D27.2(A) SW27.2(Row)
Net-(D28-2): D28.2(A) SW28.2(Row)
Net-(D29-2): D29.2(A) SW29.2(Row)
Net-(D30-2): D30.2(A) SW30.2(Row)
Net-(D31-2): D31.2(A) SW31.2(Row) SW32.2(Row)
Net-(D32-2): D32.2(A) SW33.2(Row)
Net-(D33-2): D33.2(A) SW34.2(Row)
Net-(D34-2): D34.2(A) SW35.2(Row)
Net-(D35-2): D35.2(A) SW36.2(Row) SW37.2(Row)
Net-(D36-2): D36.2(A) SW38.2(Row)
Net-(D37-2): D37.2(A) SW39.2(Row)
Net-(D38-2): D38.2(A) SW40.2(Row)
Net-(D39-2): D39.2(A) SW41.2(Row)
Net-(D40-2): D40.2(A) SW42.2(Row)
Net-(D41-2): D41.2(A) SW43.2(Row)
Net-(D42-2): D42.2(A) SW44.2(Row)
Net-(D43-2): D43.2(A) SW45.2(Row)
Net-(D44-2): D44.2(A) SW46.2(Row)
Net-(D45-2): D45.2(A) SW47.2(Row)
Net-(D46-2): D46.2(A) SW48.2(Row)
Net-(D47-2): D47.2(A) SW49.2(Row)
Net-(D48-2): D48.2(A) SW50.2(Row)
Net-(D49-2): D49.2(A) SW51.2(Row)
Net-(D50-2): D50.2(A) SW52.2(Row)
Net-(D51-2): D51.2(A) SW53.2(Row)
Net-(D52-2): D52.2(A) SW54.2(Row)
Net-(D53-2): D53.2(A) SW55.2(Row)
Net-(D54-2): D54.2(A) SW56.2(Row)
Net-(D55-2): D55.2(A) SW57.2(Row)
Net-(D56-2): D56.2(A) SW58.2(Row)
Net-(D57-2): D57.2(A) SW59.2(Row)
Net-(D58-2): D58.2(A) SW60.2(Row)
Net-(D59-2): D59.2(A) SW61.2(Row)
Net-(D60-2): D60.2(A) SW62.2(Row)
Net-(D61-2): D61.2(A) SW63.2(Row)
Net-(D62-2): D62.2(A) SW64.2(Row)
Net-(D63-2): D63.2(A) SW65.2(Row)
Net-(D64-2): D64.2(A) SW66.2(Row)
Net-(D65-2): D65.2(A) SW67.2(Row)
Net-(D66-2): D66.2(A) ENC1.D
Net-(D67-2): D67.2(A) SW68.2(Row)
Net-(D68-2): D68.2(A) SW69.2(Row)
Net-(D69-2): D69.2(A) SW70.2(Row)
Net-(D70-2): D70.2(A) SW71.2(Row)
Net-(PWR-2): PWR.2(K) R73.2
Net-(R1-2): R1.2 SW1.4(GND-LED)
Net-(R2-2): R2.2 SW2.4(GND-LED)
Net-(R3-2): R3.2 SW3.4(GND-LED)
Net-(R4-2): R4.2 SW4.4(GND-LED)
Net-(R5-2): R5.2 SW5.4(GND-LED)
Net-(R6-2): R6.2 SW6.4(GND-LED)
Net-(R7-2): R7.2 SW7.4(GND-LED)
Net-(R8-2): R8.2 SW8.4(GND-LED)
Net-(R9-2): R9.2 SW9.4(GND-LED)
Net-(R10-2): R10.2 SW10.4(GND-LED)
Net-(R11-2): R11.2 SW11.4(GND-LED)
Net-(R12-2): R12.2 SW12.4(GND-LED)
Net-(R13-2): R13.2 SW13.4(GND-LED)
Net-(R14-2): R14.2 SW14.4(GND-LED)
Net-(R15-2): R15.2 SW15.4(GND-LED)
Net-(R16-2): R16.2 SW16.4(GND-LED)
Net-(R17-2): R17.2 SW17.4(GND-LED)
Net-(R18-2): R18.2 SW18.4(GND-LED)
Net-(R19-2): R19.2 SW19.4(GND-LED)
Net-(R20-2): R20.2 SW20.4(GND-LED)
Net-(R21-2): R21.2 SW21.4(GND-LED)
Net-(R22-2): R22.2 SW22.4(GND-LED)
Net-(R23-2): R23.2 SW23.4(GND-LED)
Net-(R24-2): R24.2 SW24.4(GND-LED)
Net-(R25-2): R25.2 SW25.4(GND-LED)
Net-(R26-2): R26.2 SW26.4(GND-LED)
Net-(R27-2): R27.2 SW27.4(GND-LED)
Net-(R28-2): R28.2 SW28.4(GND-LED)
Net-(R29-2): R29.2 SW29.4(GND-LED)
Net-(R30-2): R30.2 SW30.4(GND-LED)
Net-(R31-2): R31.2 SW31.4(GND-LED) SW32.4(GND-LED)
Net-(R32-2): R32.2 SW33.4(GND-LED)
Net-(R33-2): R33.2 SW34.4(GND-LED)
Net-(R34-2): R34.2 SW35.4(GND-LED)
Net-(R35-2): R35.2 SW36.4(GND-LED) SW37.4(GND-LED)
Net-(R36-2): R36.2 SW38.4(GND-LED)
Net-(R37-2): R37.2 SW39.4(GND-LED)
Net-(R38-2): R38.2 SW40.4(GND-LED)
Net-(R39-2): R39.2 SW41.4(GND-LED)
Net-(R40-2): R40.2 SW42.4(GND-LED)
Net-(R41-2): R41.2 SW43.4(GND-LED)
Net-(R42-2): R42.2 SW44.4(GND-LED)
Net-(R43-2): R43.2 SW45.4(GND-LED)
Net-(R44-2): R44.2 SW46.4(GND-LED)
Net-(R45-2): R45.2 SW47.4(GND-LED)
Net-(R46-2): R46.2 SW48.4(GND-LED)
Net-(R47-2): R47.2 SW49.4(GND-LED)
Net-(R48-2): R48.2 SW50.4(GND-LED)
Net-(R49-2): R49.2 SW51.4(GND-LED)
Net-(R50-2): R50.2 SW52.4(GND-LED)
Net-(R51-2): R51.2 SW53.4(GND-LED)
Net-(R52-2): R52.2 SW54.4(GND-LED)
Net-(R53-2): R53.2 SW55.4(GND-LED)
Net-(R54-2): R54.2 SW56.4(GND-LED)
Net-(R55-2): R55.2 SW57.4(GND-LED)
Net-(R56-2): R56.2 SW58.4(GND-LED)
Net-(R57-2): R57.2 SW59.4(GND-LED)
Net-(R58-2): R58.2 SW60.4(GND-LED)
Net-(R59-2): R59.2 SW61.4(GND-LED)
Net-(R60-2): R60.2 SW62.4(GND-LED)
Net-(R61-2): R61.2 SW63.4(GND-LED)
Net-(R62-2): R62.2 SW64.4(GND-LED)
Net-(R63-2): R63.2 SW65.4(GND-LED)
Net-(R64-2): R64.2 SW66.4(GND-LED)
Net-(R65-2): R65.2 SW67.4(GND-LED)
Net-(R66-2): R66.2 SW68.4(GND-LED)
Net-(R67-2): R67.2 SW69.4(GND-LED)
Net-(R68-2): R68.2 SW70.4(GND-LED)
Net-(R69-2): R69.2 SW71.4(GND-LED)
Net-(R70-1): R70.1 U1.3(D-)
Net-(R71-1): R71.1 U1.4(D+)
Net-(R72-2): R72.2 U1.33(PE2(HWB#))
Net-(R74-1): R74.1 USBC1.A5(CC1)
Net-(R75-2): R75.2 USBC1.B5(CC2)

Not connected (* = marked no-connect by the designer): ENC1 6* 7*; U1 1(PE6(INT.6/AIN0))*; USBC1 0* A8(SBU1)* B8(SBU2)*

## Notes on the sheets
sheet 1
- ESD Protection
- Power LED
- ATMEGA32U4-MUR
- SMT standoffs. All connected to ground.
- DIP switch. One pin to
  ground other to
  GPIO pin of the MCU.
- header/pins for:
  "SSD1306" 128x32 OLED.
- Pins 1 and 6 used
  to toggle
  LEDs on the switches.
- Coupling Capcitors
- DIP SW
- OLED
- Type-C
- Stabilizer footprint.
- Reset
